# Altium schematic sheet Power_Protection_VIN.SchDoc
size A4; Organization: UltraZohm; SheetNumber: 38; SheetTotal: 40
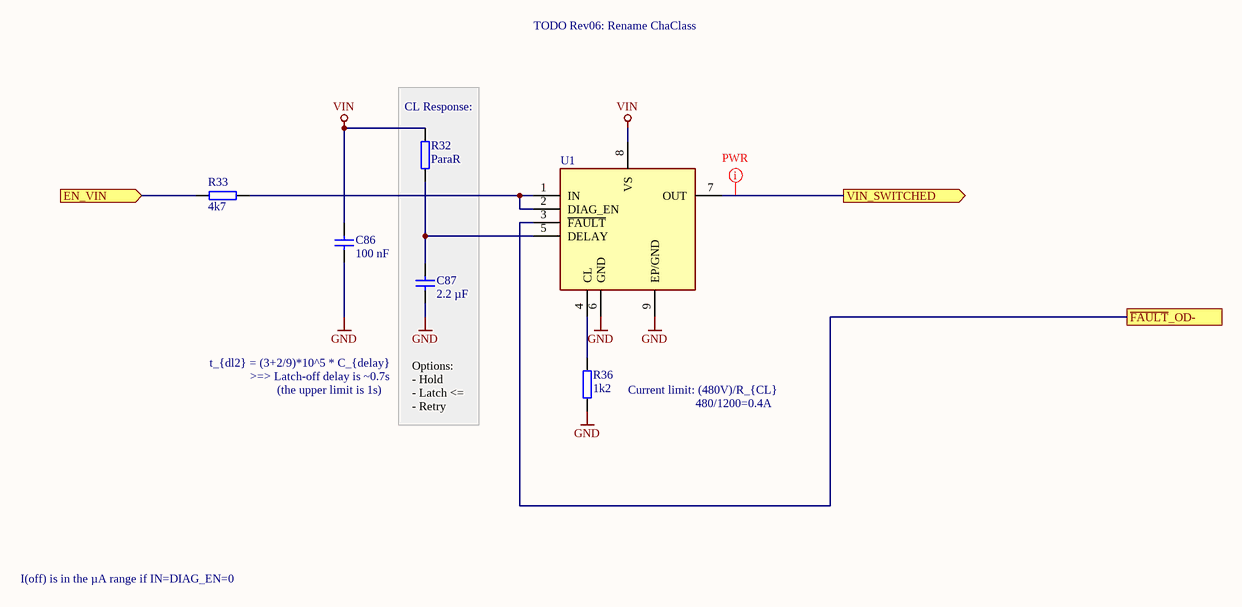
[diagram p0: Power_Protection_VIN.SchDoc]

## Parts
C86  100 nF  [C_0603_TE]
C87  2.2 µF  [C_0603_TE]
R32  ParaR  [R_0603_TE]
R33  4k7  [R_0603_TE]
R36  1k2  [R_0603_TE]
U1  TPS1H000AQDGNRQ1  [SOP65P490X110-9N]  (value not drawn)

## Blocks framed on the sheet
CL Response:: C87 R32

## Ports
EN_VIN (in), VIN_SWITCHED (out), ~{FAULT}_OD-

## Nets
GND: C86.1 C87.1 R36.1 U1.6(GND) U1.9(EP/GND)
VIN: C86.2 R32.2 U1.8(VS)
EN_VIN: R33.1 ; port EN_VIN
~{FAULT}_OD-: U1.3(~{FAULT}) ; port ~{FAULT}_OD-
VIN_SWITCHED: U1.7(OUT) ; port VIN_SWITCHED
NetC87_2: C87.2 R32.1 U1.5(DELAY)
NetR33_2: R33.2 U1.1(IN) U1.2(DIAG_EN)
NetR36_2: R36.2 U1.4(CL)

## Layout directives
net class PWR: VIN_SWITCHED

## Notes on the sheet
- TODO Rev06: Rename ChaClass
- t_{dl2} = (3+2/9)*10^5 * C_{delay}
- >=> Latch-off delay is ~0.7s
- (the upper limit is 1s)
- Options:
  - Hold
  - Latch <=
  - Retry
- (near R36) Current limit: (480V)/R_{CL}
- 480/1200=0.4A
- I(off) is in the µA range if IN=DIAG_EN=0
- Title
- Revision:
- Design Engineer:
- Date:
- Project:
- Sheet
- of

## Library data of the parts
C86 = UZgen_C_0603_100nF_50V_X7R: Generic capacitor; Manufacturer: UZgen; Voltage: 50V; Tolerance: 10 %; Created from: AGeiger; Manufacturer Part Number: UZgen_C_0603_100nF_50V_X7R; PartID: 1; Created On: 02/07/2024 14:42:23; Value: 100 nF; Device Package: 0603; Technology: X7R; Mounting Type: SMD; Last Updated: 08/08/2024 15:01:15
C87 = UZgen_C_0603_2.2uF_50V_X7R: Generic capacitor; Manufacturer: UZgen; Voltage: 50V; Tolerance: 10 %; Created from: UZgenTool; Manufacturer Part Number: UZgen_C_0603_2.2uF_50V_X7R; PartID: 4317; Created On: 02/08/2024 11:18:10; Value: 2.2 µF; Device Package: 0603; Technology: X7R; Mounting Type: SMD; Last Updated: 02/08/2024 11:18:10
R32 = UZgen_R_0603_ParaR: Generic resistor (parametric); Manufacturer: UZgen; Tolerance: 1 %; Created from: UZgenTool; Manufacturer Part Number: UZgen_R_0603_ParaR; PartID: 588; Created On: 08/07/2024 14:34:30; Value: ParaR; Device Package: 0603; Mounting Type: SMD; Last Updated: 08/07/2024 14:34:30
R33 = UZgen_R_0603_4k7: Generic resistor; Manufacturer: UZgen; Tolerance: 1 %; Created from: UZgenTool; Manufacturer Part Number: UZgen_R_0603_4k7; PartID: 237; Created On: 02/07/2024 17:29:50; Value: 4k7; Device Package: 0603; Mounting Type: SMD; Last Updated: 02/07/2024 17:29:50
R36 = UZgen_R_0603_1k2: Generic resistor; Manufacturer: UZgen; Tolerance: 1 %; Created from: UZgenTool; Manufacturer Part Number: UZgen_R_0603_1k2; PartID: 223; Created On: 02/07/2024 17:29:49; Value: 1k2; Device Package: 0603; Mounting Type: SMD; Last Updated: 02/07/2024 17:29:49
U1 = TPS1H000AQDGNRQ1: Power Switch ICs - Power Distribution 40-V, 1-ohm, 1-ch automotive smart high-side switch with adjustable current limit 8-HVSSOP -40 to 125; Manufacturer: Texas Instruments; Created from: FRosner; Manufacturer Part Number: TPS1H000AQDGNRQ1; PartID: 7; Created On: 15/07/2024 07:35:11; ComponentLink1Description: Datasheet; ComponentLink1URL: https://www.ti.com/lit/ds/symlink/tps1h000-q1.pdf?ts=1721023478997&ref_url=https%253A%252F%252Fwww.mouser.de%252F; Component Type: Power Switch ICs; Device Package: MSOP-PowerPad-8; Last Updated: 15/07/2024 07:35:11; Mounting Type: SMD; Operating Temperature: -40 to +125 °C; Series: TPS1H000-Q1; Supplier 1: Mouser; Supplier Part Number 1: 595-TPS1H000AQDGNRQ1; Supplier 2: LCSC; Supplier Part Number 2: C2653764; Value: TPS1H000AQDGNRQ1; LCSC Part Number: C2653764